# Altium schematic sheet Power.SchDoc: Power
size B; CheckedBy: Panagiotis Gkountoumis; DocumentNumber: 4; SheetNumber: 4; SheetTotal: 4
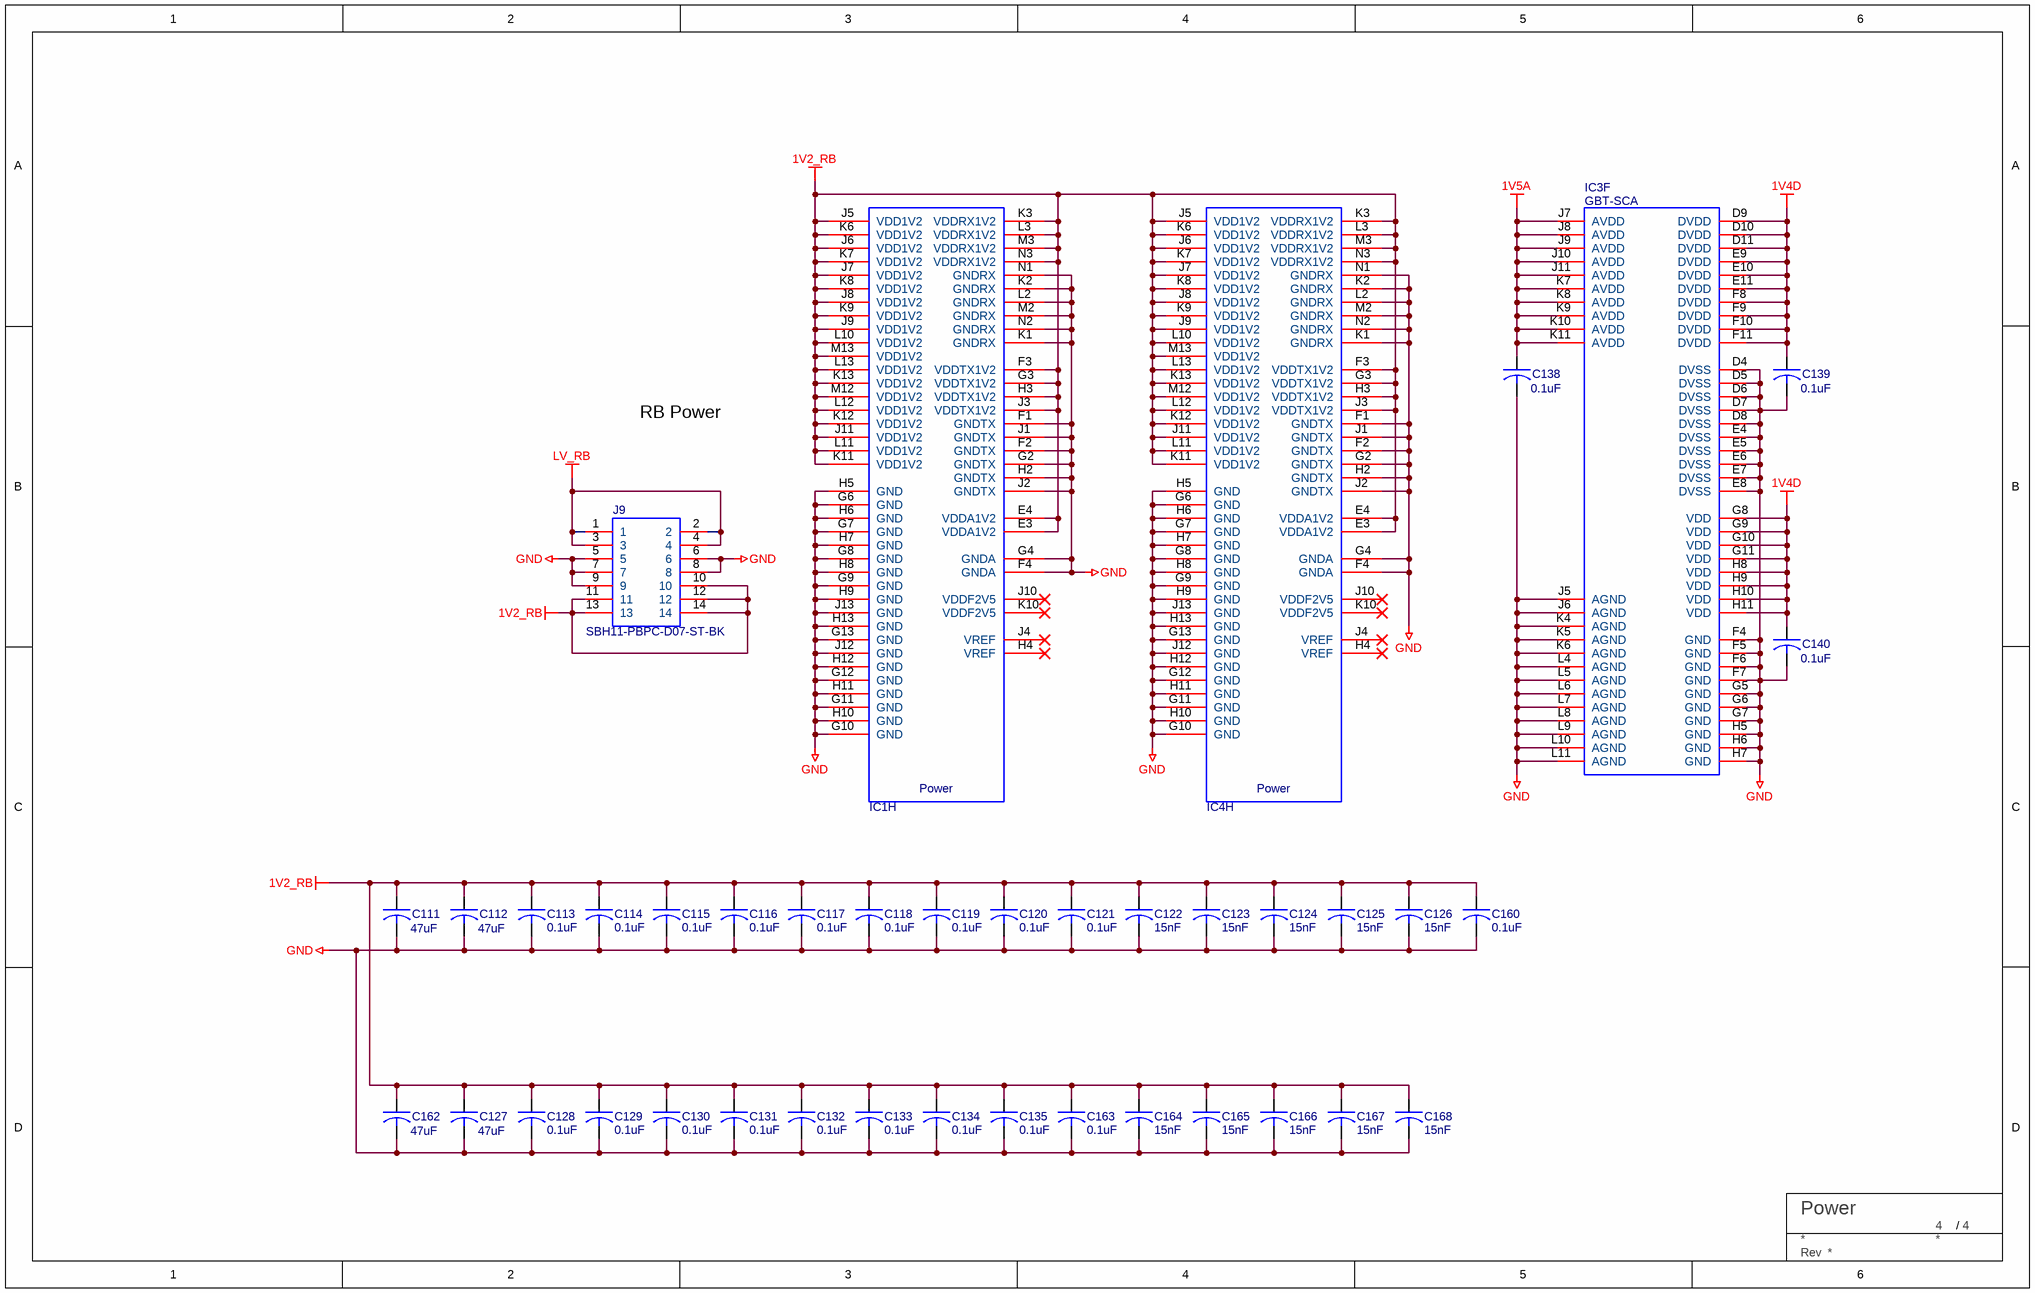
[diagram p0: Power.SchDoc]

## Parts
C111  value 47uF  [capc2012n]  (hidden comment: GRM188R60J476ME15D)
C112  value 47uF  [capc2012n]  (hidden comment: GRM188R60J476ME15D)
C113  value 0.1uF  [capc0603n]  (hidden comment: GRM033R61C104KE84D)
C114  value 0.1uF  [capc0603n]  (hidden comment: GRM033R61C104KE84D)
C115  value 0.1uF  [capc0603n]  (hidden comment: GRM033R61C104KE84D)
C116  value 0.1uF  [capc0603n]  (hidden comment: GRM033R61C104KE84D)
C117  value 0.1uF  [capc0603n]  (hidden comment: GRM033R61C104KE84D)
C118  value 0.1uF  [capc0603n]  (hidden comment: GRM033R61C104KE84D)
C119  value 0.1uF  [capc0603n]  (hidden comment: GRM033R61C104KE84D)
C120  value 0.1uF  [capc0603n]  (hidden comment: GRM033R61C104KE84D)
C121  value 0.1uF  [capc0603n]  (hidden comment: GRM033R61C104KE84D)
C122  value 15nF  [capc0603n]  (hidden comment: GRM033R61C153KE84D)
C123  value 15nF  [capc0603n]  (hidden comment: GRM033R61C153KE84D)
C124  value 15nF  [capc0603n]  (hidden comment: GRM033R61C153KE84D)
C125  value 15nF  [capc0603n]  (hidden comment: GRM033R61C153KE84D)
C126  value 15nF  [capc0603n]  (hidden comment: GRM033R61C153KE84D)
C127  value 47uF  [capc2012n]  (hidden comment: GRM188R60J476ME15D)
C128  value 0.1uF  [capc0603n]  (hidden comment: GRM033R61C104KE84D)
C129  value 0.1uF  [capc0603n]  (hidden comment: GRM033R61C104KE84D)
C130  value 0.1uF  [capc0603n]  (hidden comment: GRM033R61C104KE84D)
C131  value 0.1uF  [capc0603n]  (hidden comment: GRM033R61C104KE84D)
C132  value 0.1uF  [capc0603n]  (hidden comment: GRM033R61C104KE84D)
C133  value 0.1uF  [capc0603n]  (hidden comment: GRM033R61C104KE84D)
C134  value 0.1uF  [capc0603n]  (hidden comment: GRM033R61C104KE84D)
C135  value 0.1uF  [capc0603n]  (hidden comment: GRM033R61C104KE84D)
C138  value 0.1uF  [capc1005n]  (hidden comment: GRM155R71E104ME14D)
C139  value 0.1uF  [capc1005n]  (hidden comment: GRM155R71E104ME14D)
C140  value 0.1uF  [capc1005n]  (hidden comment: GRM155R71E104ME14D)
C160  value 0.1uF  [capc1005n]  (hidden comment: GRM155R71E104ME14D)
C162  value 47uF  [capc2012n]  (hidden comment: GRM188R60J476ME15D)
C163  value 0.1uF  [capc0603n]  (hidden comment: GRM033R61C104KE84D)
C164  value 15nF  [capc0603n]  (hidden comment: GRM033R61C153KE84D)
C165  value 15nF  [capc0603n]  (hidden comment: GRM033R61C153KE84D)
C166  value 15nF  [capc0603n]  (hidden comment: GRM033R61C153KE84D)
C167  value 15nF  [capc0603n]  (hidden comment: GRM033R61C153KE84D)
C168  value 15nF  [capc0603n]  (hidden comment: GRM033R61C153KE84D)
IC1  LPGBT  [BGA289X17]  (value not drawn)  (part H of 8)
IC3  GBT-SCA  [BGA196C80P14X14_1200X1200X170]  (part F of 6)
IC4  LPGBT  [BGA289X17]  (value not drawn)  (part H of 8)
J9  SBH11-PBPC-D07-ST-BK  [SHDR14W64P254_2X7_2528X910X910P]
TBLOCK?  BU Title block  (value not drawn)  (graphical)

## Nets
1V2_RB: C111.1 C112.1 C113.1 C114.1 C115.1 C116.1 C117.1 C118.1 C119.1 C120.1 C121.1 C122.1 C123.1 C124.1 C125.1 C126.1 C127.1 C128.1 C129.1 C130.1 C131.1 C132.1 C133.1 C134.1 C135.1 C160.1 C162.1 C163.1 C164.1 C165.1 C166.1 C167.1 C168.1 IC1.E3(VDDA1V2) IC1.E4(VDDA1V2) IC1.F3(VDDTX1V2) IC1.G3(VDDTX1V2) IC1.H3(VDDTX1V2) IC1.J3(VDDTX1V2) IC1.J5(VDD1V2) IC1.J6(VDD1V2) IC1.J7(VDD1V2) IC1.J8(VDD1V2) IC1.J9(VDD1V2) IC1.J11(VDD1V2) IC1.K3(VDDRX1V2) IC1.K6(VDD1V2) IC1.K7(VDD1V2) IC1.K8(VDD1V2) IC1.K9(VDD1V2) IC1.K11(VDD1V2) IC1.K12(VDD1V2) IC1.K13(VDD1V2) IC1.L3(VDDRX1V2) IC1.L10(VDD1V2) IC1.L11(VDD1V2) IC1.L12(VDD1V2) IC1.L13(VDD1V2) IC1.M3(VDDRX1V2) IC1.M12(VDD1V2) IC1.M13(VDD1V2) IC1.N3(VDDRX1V2) IC4.E3(VDDA1V2) IC4.E4(VDDA1V2) IC4.F3(VDDTX1V2) IC4.G3(VDDTX1V2) IC4.H3(VDDTX1V2) IC4.J3(VDDTX1V2) IC4.J5(VDD1V2) IC4.J6(VDD1V2) IC4.J7(VDD1V2) IC4.J8(VDD1V2) IC4.J9(VDD1V2) IC4.J11(VDD1V2) IC4.K3(VDDRX1V2) IC4.K6(VDD1V2) IC4.K7(VDD1V2) IC4.K8(VDD1V2) IC4.K9(VDD1V2) IC4.K11(VDD1V2) IC4.K12(VDD1V2) IC4.K13(VDD1V2) IC4.L3(VDDRX1V2) IC4.L10(VDD1V2) IC4.L11(VDD1V2) IC4.L12(VDD1V2) IC4.L13(VDD1V2) IC4.M3(VDDRX1V2) IC4.M12(VDD1V2) IC4.M13(VDD1V2) IC4.N3(VDDRX1V2) J9.10 J9.11 J9.12 J9.13 J9.14
1V4D: C139.1 C140.1 IC3.D9(DVDD) IC3.D10(DVDD) IC3.D11(DVDD) IC3.E9(DVDD) IC3.E10(DVDD) IC3.E11(DVDD) IC3.F8(DVDD) IC3.F9(DVDD) IC3.F10(DVDD) IC3.F11(DVDD) IC3.G8(VDD) IC3.G9(VDD) IC3.G10(VDD) IC3.G11(VDD) IC3.H8(VDD) IC3.H9(VDD) IC3.H10(VDD) IC3.H11(VDD)
1V5A: C138.1 IC3.J7(AVDD) IC3.J8(AVDD) IC3.J9(AVDD) IC3.J10(AVDD) IC3.J11(AVDD) IC3.K7(AVDD) IC3.K8(AVDD) IC3.K9(AVDD) IC3.K10(AVDD) IC3.K11(AVDD)
GND: C111.2 C112.2 C113.2 C114.2 C115.2 C116.2 C117.2 C118.2 C119.2 C120.2 C121.2 C122.2 C123.2 C124.2 C125.2 C126.2 C127.2 C128.2 C129.2 C130.2 C131.2 C132.2 C133.2 C134.2 C135.2 C138.2 C139.2 C140.2 C160.2 C162.2 C163.2 C164.2 C165.2 C166.2 C167.2 C168.2 IC1.F1(GNDTX) IC1.F2(GNDTX) IC1.F4(GNDA) IC1.G2(GNDTX) IC1.G4(GNDA) IC1.G6(GND) IC1.G7(GND) IC1.G8(GND) IC1.G9(GND) IC1.G10(GND) IC1.G11(GND) IC1.G12(GND) IC1.G13(GND) IC1.H2(GNDTX) IC1.H5(GND) IC1.H6(GND) IC1.H7(GND) IC1.H8(GND) IC1.H9(GND) IC1.H10(GND) IC1.H11(GND) IC1.H12(GND) IC1.H13(GND) IC1.J1(GNDTX) IC1.J2(GNDTX) IC1.J12(GND) IC1.J13(GND) IC1.K1(GNDRX) IC1.K2(GNDRX) IC1.L2(GNDRX) IC1.M2(GNDRX) IC1.N1(GNDRX) IC1.N2(GNDRX) IC3.D4(DVSS) IC3.D5(DVSS) IC3.D6(DVSS) IC3.D7(DVSS) IC3.D8(DVSS) IC3.E4(DVSS) IC3.E5(DVSS) IC3.E6(DVSS) IC3.E7(DVSS) IC3.E8(DVSS) IC3.F4(GND) IC3.F5(GND) IC3.F6(GND) IC3.F7(GND) IC3.G5(GND) IC3.G6(GND) IC3.G7(GND) IC3.H5(GND) IC3.H6(GND) IC3.H7(GND) IC3.J5(AGND) IC3.J6(AGND) IC3.K4(AGND) IC3.K5(AGND) IC3.K6(AGND) IC3.L4(AGND) IC3.L5(AGND) IC3.L6(AGND) IC3.L7(AGND) IC3.L8(AGND) IC3.L9(AGND) IC3.L10(AGND) IC3.L11(AGND) IC4.F1(GNDTX) IC4.F2(GNDTX) IC4.F4(GNDA) IC4.G2(GNDTX) IC4.G4(GNDA) IC4.G6(GND) IC4.G7(GND) IC4.G8(GND) IC4.G9(GND) IC4.G10(GND) IC4.G11(GND) IC4.G12(GND) IC4.G13(GND) IC4.H2(GNDTX) IC4.H5(GND) IC4.H6(GND) IC4.H7(GND) IC4.H8(GND) IC4.H9(GND) IC4.H10(GND) IC4.H11(GND) IC4.H12(GND) IC4.H13(GND) IC4.J1(GNDTX) IC4.J2(GNDTX) IC4.J12(GND) IC4.J13(GND) IC4.K1(GNDRX) IC4.K2(GNDRX) IC4.L2(GNDRX) IC4.M2(GNDRX) IC4.N1(GNDRX) IC4.N2(GNDRX) J9.5 J9.6 J9.7 J9.8 J9.9
LV_RB: J9.1 J9.2 J9.3 J9.4

Not connected (* = marked no-connect by the designer): IC1 H4(VREF)* J4(VREF)* J10(VDDF2V5)* K10(VDDF2V5)*; IC4 H4(VREF)* J4(VREF)* J10(VDDF2V5)* K10(VDDF2V5)*

## Notes on the sheet
- RB Power
- (in symbol LPGBT, part H) Power
- (in symbol TITLE_BLOCK_BU) /; Rev

## Library data of the parts
C111-C135 C138-C140 C160 C162-C168 = C: CERAMIC CAPACITOR
IC1 IC4 = LPGBT: Low Power Gigabit Transceiver; Manufacturer: CERN; Pinout Version: 180226; Bonding: No; Device: LPGBT; Manufacturer Part Number: LPGBT; SMD: Yes; Mounted: Yes; LatestRevisionDate: 26.10.2018; PackageDescription: BGA, 289-Leads, Body 9.00x9.00mmx1.28mm, Pitch 0.50mm; Part Description: Low Power Gigabit Transceiver; Case: BGA289; Part Number: LPGBT; Pin Count: 289; Socket: No; Component Kind: Standard; Component Type: Standard; Footprint: BGA289C50P17X17_900X900X128
IC3 = CERN_GBT-SCA_REV 6.2: The Slow Control Adapter ASIC for the GBT System; Device: GBT-SCA
J9 = SBH11-PBPC-D07-ST-BK: Connector; Manufacturer_Name: Sullins; Datasheet Link: https://drawings-pdf.s3.amazonaws.com/11091.pdf; Height: 9.1mm; Manufacturer_Part_Number: SBH11-PBPC-D07-ST-BK
TBLOCK? = TITLE_BLOCK_BU